# Altium schematic sheet power.SchDoc
size A; SheetNumber: 3; SheetTotal: 8
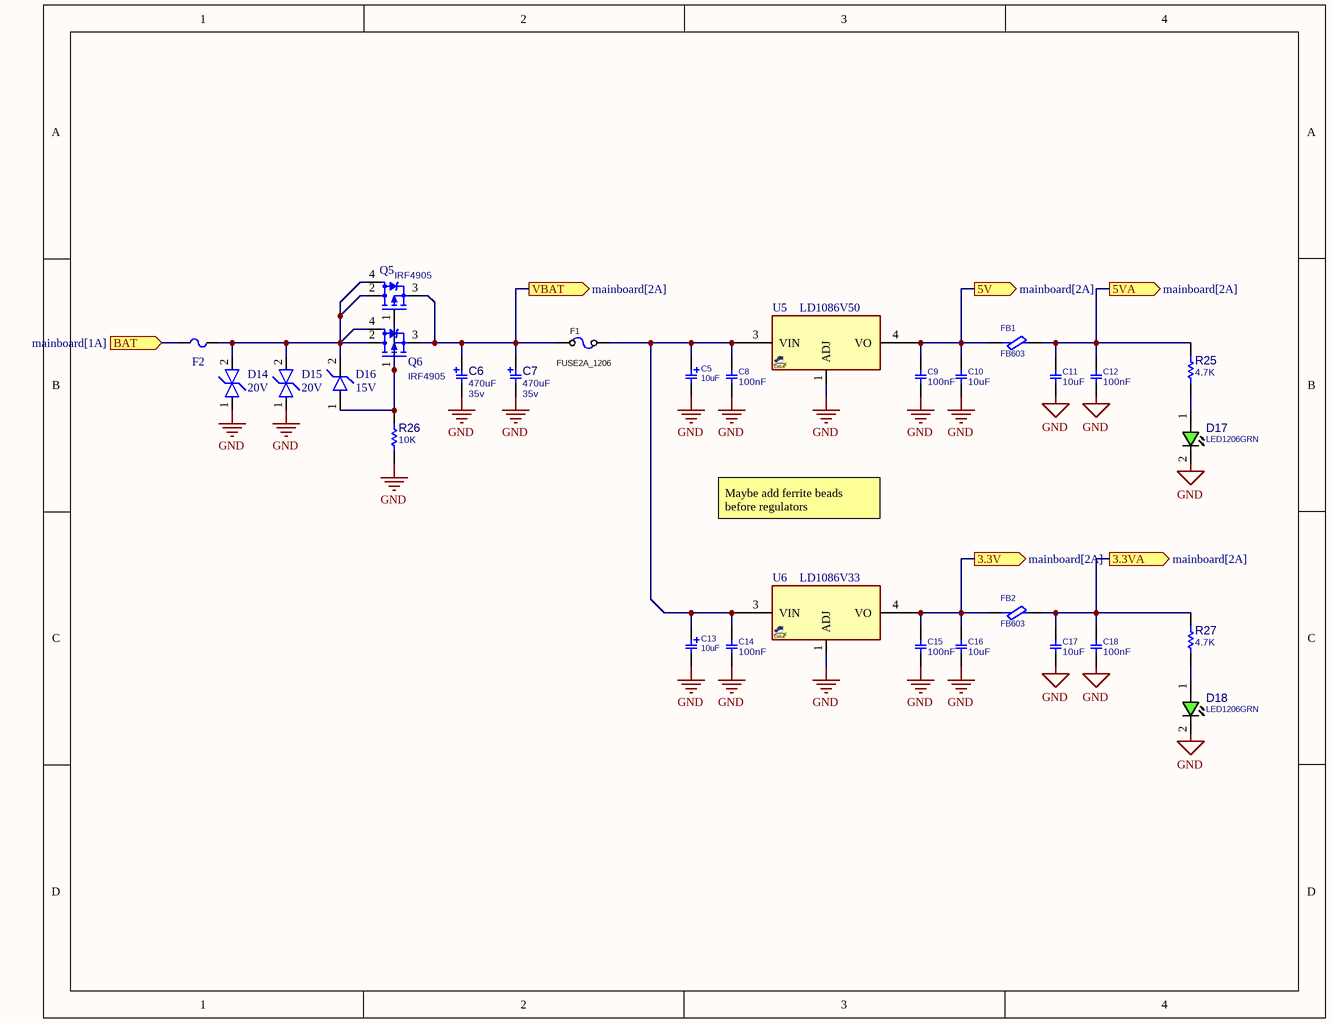
[diagram p0: power.SchDoc]

## Parts
C5  10uF  [C_TN_7343]
C6  PARAM2: 35v  [C_EL_D10L10]  (hidden comment: 470uF)
C7  PARAM2: 35v  [C_EL_D10L10]  (hidden comment: 470uF)
C8  100nF  [C1206]
C9  100nF  [C1206]
C10  10uF  [C1206]
C11  10uF  [C1206]
C12  100nF  [C1206]
C13  10uF  [C_TN_7343]
C14  100nF  [C1206]
C15  100nF  [C1206]
C16  10uF  [C1206]
C17  10uF  [C1206]
C18  100nF  [C1206]
D14  20V  [FP-SMBJ-CA-MFG]
D15  20V  [FP-SMBJ-CA-MFG]
D16  15V  [D_SOD80]
D17  LED1206GRN  [LED1206GRN]
D18  LED1206GRN  [LED1206GRN]
F1  FUSE2A_1206  [F1206]
F2  F=1.0 A  [FUSE - Double PAD]  (value not drawn)
FB1  FB603  [L1206]
FB2  FB603  [L1206]
Q5  IRF4905  [D2PAK_3]
Q6  IRF4905  [D2PAK_3]
R25  4.7K  [R1206]
R26  10K  [R1206]
R27  4.7K  [R1206]
U5  LD1086V50  [DPAK_3]
U6  LD1086V33  [DPAK_3]

## Ports
3.3V (out, see mainboard[2A]), 3.3VA (out, see mainboard[2A]), 5V (out, see mainboard[2A]), 5VA (out, see mainboard[2A]), BAT (in, see mainboard[1A]), VBAT (out, see mainboard[2A])

## Nets
GND: C5.2 C6.2 C7.2 C8.1 C9.1 C10.1 C11.1 C12.1 C13.2 C14.1 C15.1 C16.1 C17.1 C18.1 D14.1 D15.1 D17.2(CATHODE) D18.2(CATHODE) R26.1 U5.1(ADJ) U6.1(ADJ)
3.3V: C15.2 C16.2 FB2.2 U6.4(VO) ; port 3.3V
3.3VA: C17.2 C18.2 FB2.1 R27.2 ; port 3.3VA
5V: C9.2 C10.2 FB1.2 U5.4(VO) ; port 5V
5VA: C11.2 C12.2 FB1.1 R25.2 ; port 5VA
BAT: F2.1 ; port BAT
VBAT: C6.1 C7.1 F1.1 Q5.3(S) Q6.3(S) ; port VBAT
NetC5_1: C5.1 C8.2 C13.1 C14.2 F1.2 U5.3(VIN) U6.3(VIN)
NetD14_2: D14.2 D15.2 D16.2 F2.2 Q5.2(D) Q5.4(D) Q6.2(D) Q6.4(D)
NetD16_1: D16.1 Q5.1(G) Q6.1(G) R26.2
NetD17_1: D17.1(ANODE) R25.1
NetD18_1: D18.1(ANODE) R27.1

## Notes on the sheet
- Maybe add ferrite beads before regulators

## Library data of the parts
C5 C13 = CAP_SMD_TAN_10uF_35V: CAP, SMD, TAN; PARAM: 20%, 300mOhm, -55~125oC; MANF: VISHAY; MANF_P#: 593D106X9035D2TE3; PARAM2: 35V; PRICE: 0.8$; VALUE: 10uF
C6 C7 = CAP_SMD_EL_470uF_35v: CAP, SMD, ELEC,; MANF_P#: MANF_PART#; DESC: DESCRIPTION; DIST#: MOUSER; PARAM: 20%; PRICE: 10= -$; MANF: MANF; ASSEMBLY: ASSEMBLY; VALUE: 470uF
C8 C9 C12 C14 C15 C18 = CAP_SMD_MLCC_1206: CAP, MLCC; PARAM: -, -%; MANF_P#: MANF_PART#; PARAM2: -V; PRICE: 100= 1$; MANF: -; ASSEMBLY: ASSEMBLY; VALUE: 100nF
C10 C11 C16 C17 = CAP_SMD_MLCC: CAP, MLCC; PARAM: C0G, 10%; DESC: CAP, MLCC, 1nF, 50V, C0G, 10%, 0402; MANF_P#: MANF_PART#; MANF: Murata; PARAM2: 50V; PRICE: 100= 1$; ASSEMBLY: ASSEMBLY; VALUE: 10uF
D14 D15 = TVS: TVS DIODE; Direction: Bidirectional; Reverse Standoff Voltage: 20V; ComponentLink2Description: Datasheet; ComponentLink2URL: https://www.bourns.com/docs/Product-Datasheets/SMBJ.pdf
D16 = Zener-SOD-80
D17 D18 = LED_SMD_1206_GRN: LED, SMD, 1206, GREEN; PARAM: 20mA; DESC: DESCRIPTION; PARAM2: 2.2V; MANF: -; ASSEMBLY: ASSEMBLY; PRICE: 36t@Javan; MANF_P#: -; VALUE: LED1206GRN
F1 = FUSE_3A_1206_SLOW: Fuse, 3A, 32VDC, 1206, SMD, Slow Blow; PARAM: 3A; 32VDC; Slow Blow; MANF: Bourns; MANF_P#: SF-1206SP300-2; PARAM2: 0.027Ohm; PRICE: 0.9$; VALUE: FUSE2A_1206
F2 = Fuse 5x20 with holdeer pins: Fuses 5x20; Designer: Abbas Basereh; Desc.: fuse with holder pins 5x20; Data: 28-12-2016
FB1 FB2 = FBEAD_SMD: FERRITE_Bead, SMD; MANF: MURATA; PARAM: 120@100MHz; PARAM2: 1A; MANF_P#: BLM15AG121SN1D; VALUE: FB603
Q5 Q6 = MOSP_IRF4905_D2PAK: HEXFET Power MOSFET; ASSEMBLY: ASSEMBLY; MANF_P#: IRF4905; VALUE: IRF4905
R25-R27 = RES_SMD_1206: RESISTOR, SMD; PARAM: 1%, 0.25W; DESC: DESCRIPTION; DIST#: MOUSER; MANF_P#: -; MANF: -; ASSEMBLY: ASSEMBLY; PRICE: -; PARAM2: -
  R25 R27: VALUE: 4.7K
  R26: VALUE: 10K
U5 U6 = VREG_1086_TO252: REG, Linear, LDO1.3, Adj, 1A, TO-252; MANF_P#: LD1086DTTR, LD1086D2MTR; MANF: ST; PARAM2: 2.8~30VIN, 1.3VDROP, 1.25VREF; PARAM: 1A
  U5: VALUE: LD1086V50
  U6: VALUE: LD1086V33